# EAGLE schematic AMR3350-V4 (EAGLE 9.2.0)
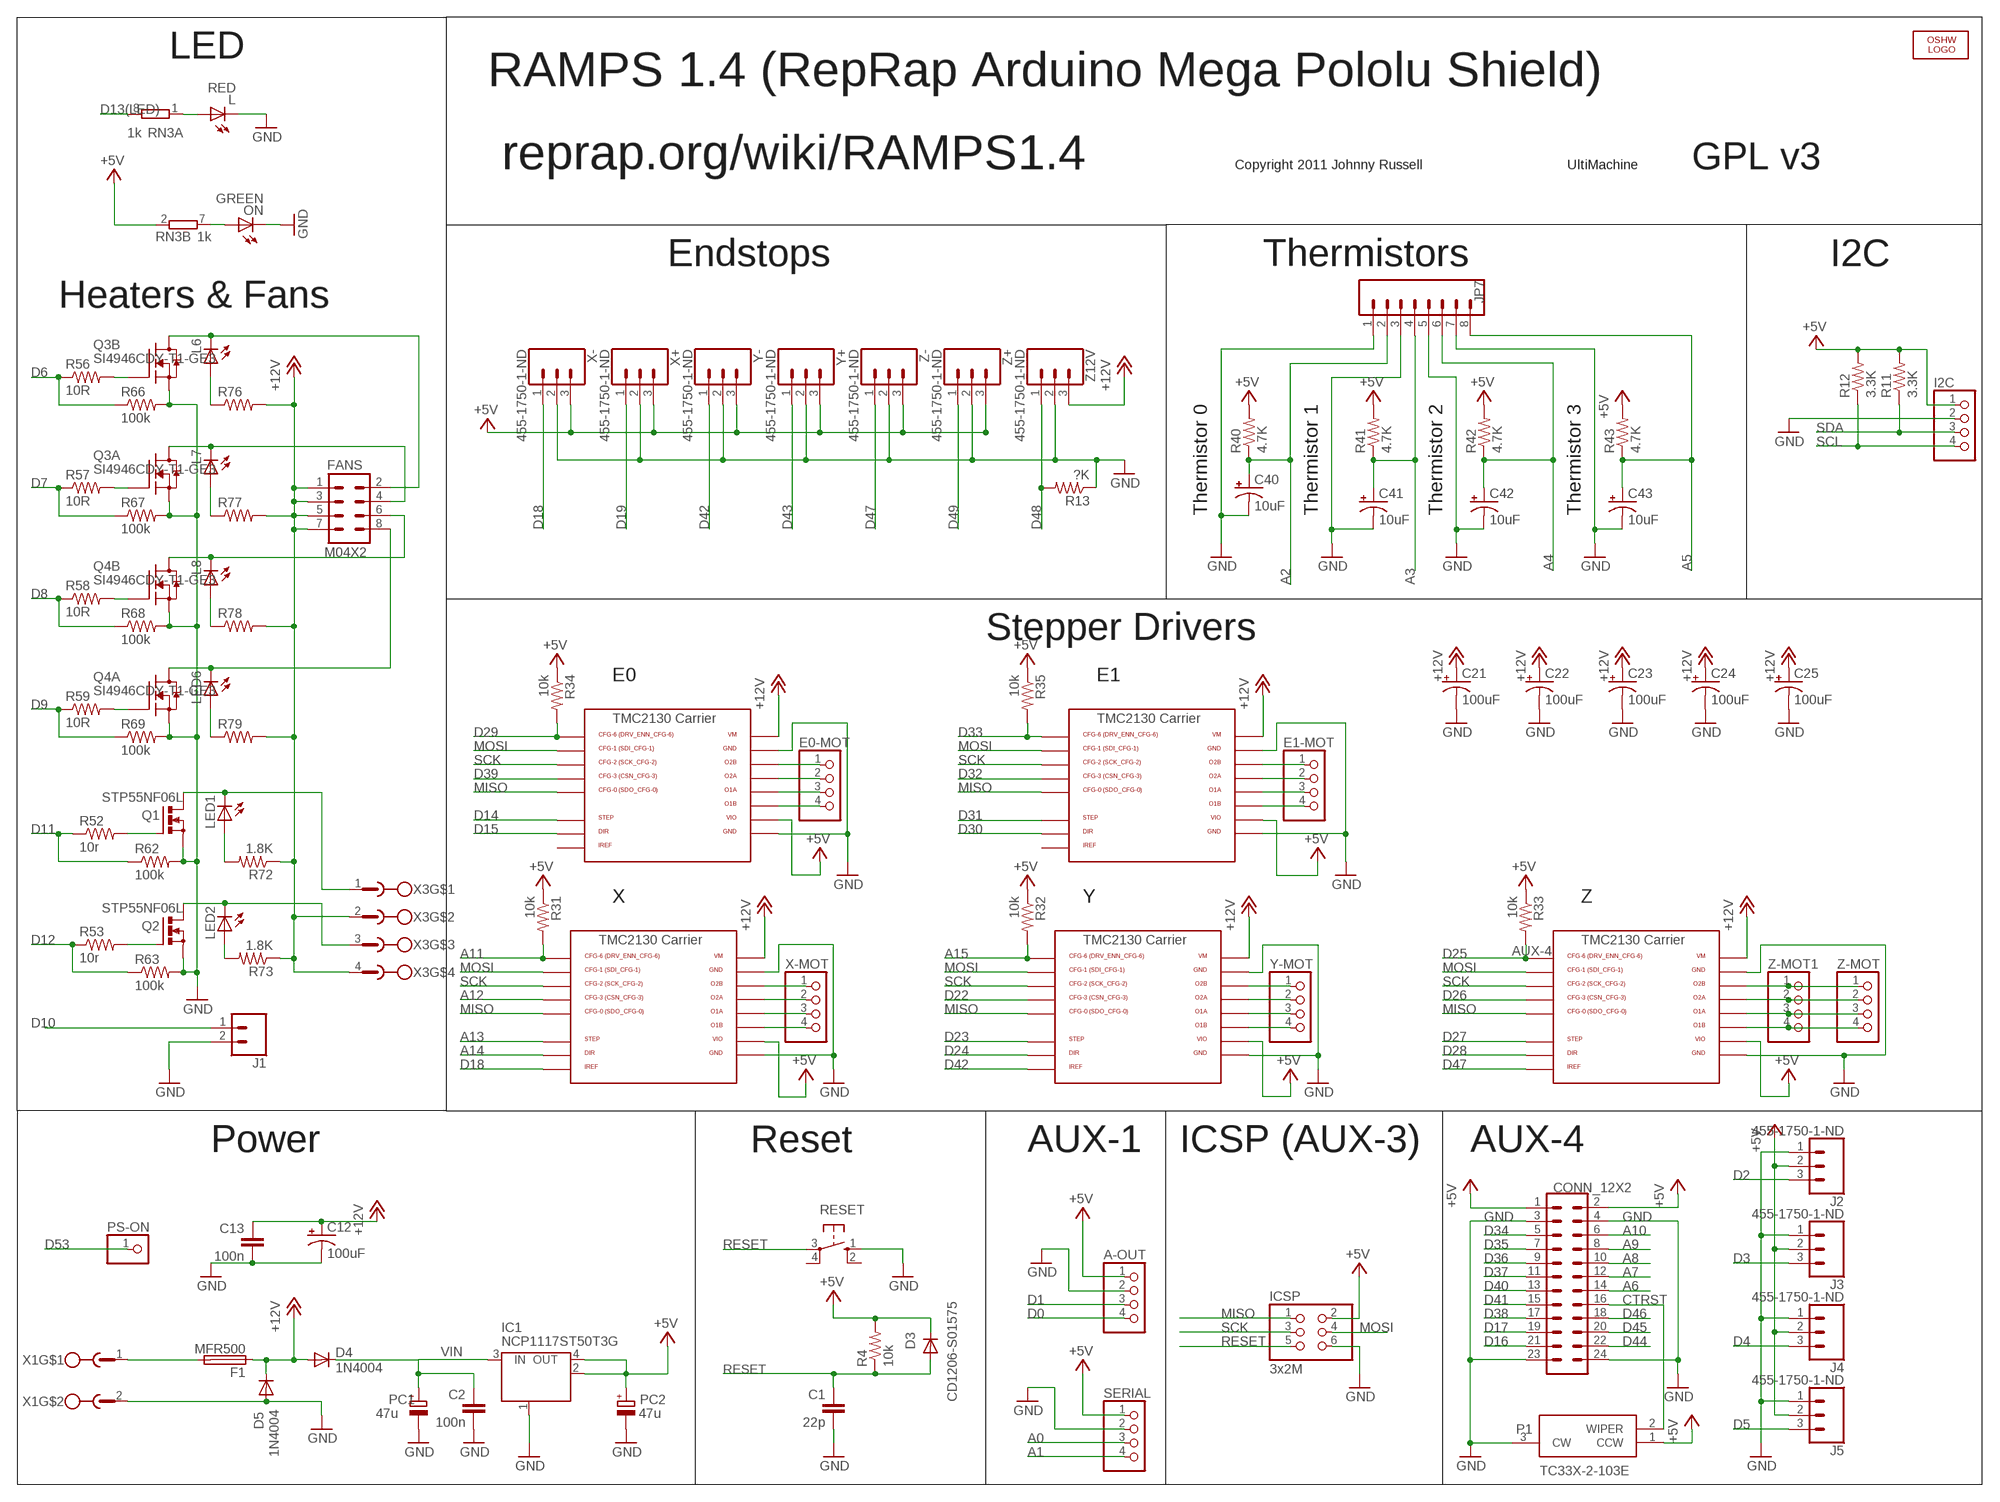
[diagram p0: schematic, sheet 1, part 1 of 2]
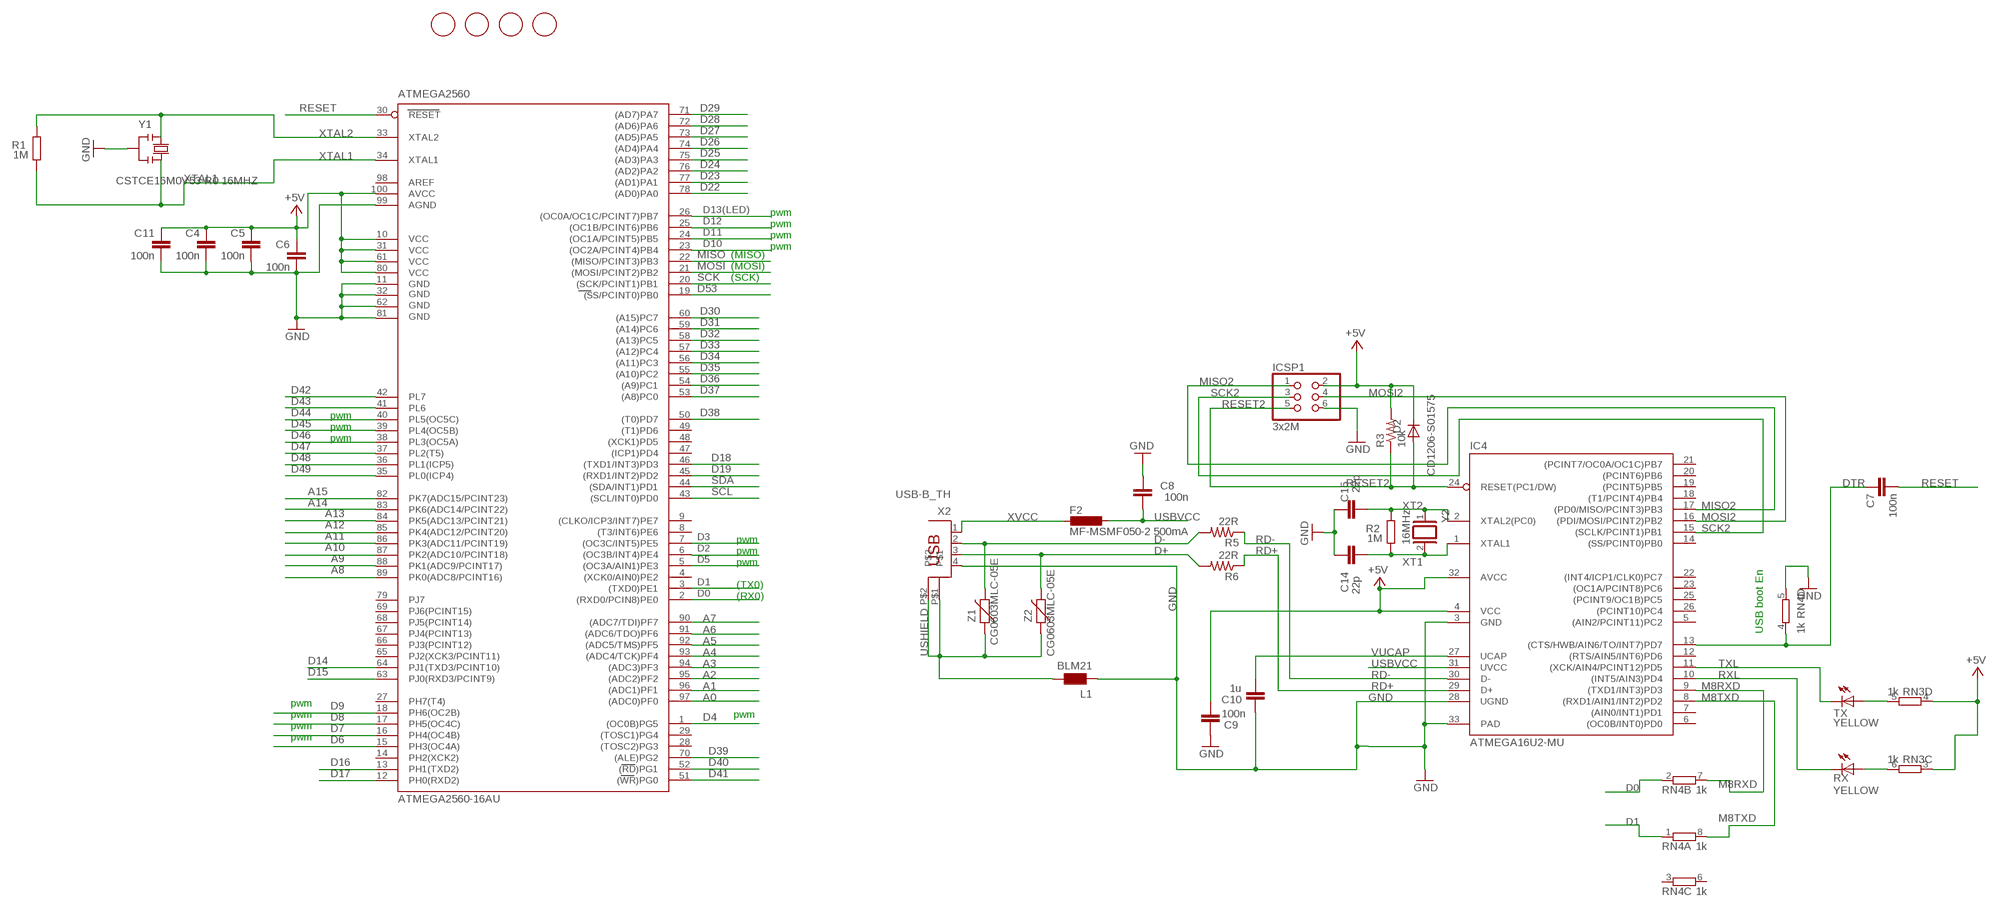
[diagram p1: schematic, sheet 1, part 2 of 2]

## Parts
A-OUT  PINHD-1X4  [1X04]
ATMEGA2560  ATMEGA2560-16AU  ATMEGA25602560-16AU  [TQFP100]
AUX-4  CONN_12X2  [2X12]
C1  22p  C-EU0603-RND  [C0603-ROUND]
C2  100n  C-EU  [C0805RND]
C4  100n  C-EU  [C0805RND]
C5  100n  C-EU0603-RND  [C0603-ROUND]
C6  100n  C-EU0603-RND  [C0603-ROUND]
C7  100n  C-EU0603-RND  [C0603-ROUND]
C8  100n  C-EU0603-RND  [C0603-ROUND]
C9  100n  C-EU0603-RND  [C0603-ROUND]
C10  1u  C-EU0603-RND  [C0603-ROUND]
C11  100n  C-EU0603-RND  [C0603-ROUND]
C12  100uF  CPOL-US153CLV-0605  [153CLV-0605]
C13  100n  C-EU0603-RND  [C0603-ROUND]
C14  22p  C-EU0603-RND  [C0603-ROUND]
C15  22p  C-EU0603-RND  [C0603-ROUND]
C21  100uF  CPOL-US153CLV-0605  [153CLV-0605]
C22  100uF  CPOL-US153CLV-0605  [153CLV-0605]
C23  100uF  CPOL-US153CLV-0605  [153CLV-0605]
C24  100uF  CPOL-US153CLV-0605  [153CLV-0605]
C25  100uF  CPOL-US153CLV-0605  [153CLV-0605]
C40  10uF  CPOL-US153CLV-0405  [153CLV-0405]
C41  10uF  CPOL-US153CLV-0405  [153CLV-0405]
C42  10uF  CPOL-US153CLV-0405  [153CLV-0405]
C43  10uF  CPOL-US153CLV-0405  [153CLV-0405]
D2  CD1206-S01575  DIODE-MINIMELF  [MINIMELF]
D3  CD1206-S01575  DIODE-MINIMELF  [MINIMELF]
D4  1N4004  [DO41-10]
D5  1N4004  [DO41-10]
E0-MOT  PINHD-1X4  [1X04]
E1-MOT  PINHD-1X4  [1X04]
F1  MFR500  PTCFUSE  [MFR500]
F2  MF-MSMF050-2 500mA  L-EUL1812  [L1812]
FANS  M04X2  [2X4]
FD1  FIDUCIALMOUNT  [FIDUCIA-MOUNT]
FD2  FIDUCIALMOUNT  [FIDUCIA-MOUNT]
FD3  FIDUCIALMOUNT  [FIDUCIA-MOUNT]
FD4  FIDUCIALMOUNT  [FIDUCIA-MOUNT]
I2C  PINHD-1X4  [1X04]
IC1  NCP1117ST50T3G  MC33269ST-3.3T3  [SOT223]
IC4  ATMEGA16U2-MU  [MLF32]
ICSP  3x2M  PINHD-2X3  [2X03]
ICSP1  3x2M  PINHD-2X3  [2X03]
J1  CONN_02  [1X02]
J2  455-1750-1-ND  CONN_03  [1X03]
J3  455-1750-1-ND  CONN_03  [1X03]
J4  455-1750-1-ND  CONN_03  [1X03]
J5  455-1750-1-ND  CONN_03  [1X03]
JP7  CONN_08"  [1X08]
L  RED  LEDCHIP-LED0805  [CHIP-LED0805]
L1  BLM21  WE-CBF_0805  [0805]
L6  LEDCHIP-LED0603  [CHIP-LED0603]
L7  LEDCHIP-LED0603  [CHIP-LED0603]
L8  LEDCHIP-LED0603  [CHIP-LED0603]
LED1  LEDCHIP-LED0805  [CHIP-LED0805]
LED2  LEDCHIP-LED0805  [CHIP-LED0805]
LED6  LEDCHIP-LED0603  [CHIP-LED0603]
LOGO2  OSHW_LOGO_6MILX0100-NT  [OSHW_6X100_NOTEXT]
ON  GREEN  LEDCHIP-LED0805  [CHIP-LED0805]
P1  TC33X-2-103E  [TC33X-2_1]
PC1  47u  CPOL-EUD  [PANASONIC_D]
PC2  47u  CPOL-EUD  [PANASONIC_D]
PS-ON  PINHD-1X1  [1X01]
Q1  STP55NF06L  IRF512  [TO220BV]
Q2  STP55NF06L  IRF512  [TO220BV]
Q3  SI4946CDY-T1-GE3  [SOIC127P600X175-8N]
Q4  SI4946CDY-T1-GE3  [SOIC127P600X175-8N]
R1  1M  R-EU_R0603  [R0603-ROUND]
R2  1M  R-EU_R0603  [R0603-ROUND]
R3  10k  R-US_R0603  [R0603]
R4  10k  R-US_R0603  [R0603]
R5  22R  R-US_R0603  [R0603]
R6  22R  R-US_R0603  [R0603]
R11  3.3K  R-US_R0603  [R0603]
R12  3.3K  R-US_R0603  [R0603]
R13  ?K  R-US_R0805  [R0805]
R31  10k  R-US_R0805  [R0805]
R32  10k  R-US_R0805  [R0805]
R33  10k  R-US_R0805  [R0805]
R34  10k  R-US_R0805  [R0805]
R35  10k  R-US_R0805  [R0805]
R40  4.7K  R-US_R0805  [R0805]
R41  4.7K  R-US_R0805  [R0805]
R42  4.7K  R-US_R0805  [R0805]
R43  4.7K  R-US_R0805  [R0805]
R52  10r  R-US_R0805  [R0805]
R53  10r  R-US_M0805  [M0805]
R56  10R  R-US_R0603  [R0603]
R57  10R  R-US_R0603  [R0603]
R58  10R  R-US_R0603  [R0603]
R59  10R  R-US_R0603  [R0603]
R62  100k  R-US_R0805  [R0805]
R63  100k  R-US_R0805  [R0805]
R66  100k  R-US_R0603  [R0603]
R67  100k  R-US_R0603  [R0603]
R68  100k  R-US_R0603  [R0603]
R69  100k  R-US_R0603  [R0603]
R72  1.8K  R-US_R0805  [R0805]
R73  1.8K  R-US_R0805  [R0805]
R76  R-US_R0603  [R0603]
R77  R-US_R0603  [R0603]
R78  R-US_R0603  [R0603]
R79  R-US_R0603  [R0603]
RESET  10-XX  [B3F-10XX]
RN3  1k  4R-NCAY16  [CAY16]
RN4  1k  4R-NCAY16  [CAY16]
RX  YELLOW  LEDCHIP-LED0805  [CHIP-LED0805]
SERIAL  PINHD-1X4  [1X04]
TX  YELLOW  LEDCHIP-LED0805  [CHIP-LED0805]
U$1  TMC2130BREAKOUT  [TMC2130BREAKOUT]
U$2  TMC2130BREAKOUT  [TMC2130BREAKOUT]
U$3  TMC2130BREAKOUT  [TMC2130BREAKOUT]
U$4  TMC2130BREAKOUT  [TMC2130BREAKOUT]
U$5  TMC2130BREAKOUT  [TMC2130BREAKOUT]
X1  2-PIN  [2-PIN]
X2  USB-B_TH  PN61729NOSILK  [PN61729-NOSILK]
X3  4-PIN  [4-PIN]
X+  455-1750-1-ND  CONN_03  [1X03]
X-  455-1750-1-ND  CONN_03  [1X03]
X-MOT  PINHD-1X4  [1X04]
Y1  CSTCE16M0V53-R0 16MHZ  RESONATORMU  [RESONATOR]
Y2  16MHz  XTAL/S  [QS]
Y+  455-1750-1-ND  CONN_03  [1X03]
Y-  455-1750-1-ND  CONN_03  [1X03]
Y-MOT  PINHD-1X4  [1X04]
Z1  CG0603MLC-05E  VARISTORCN0603  [CT/CN0603]
Z2  CG0603MLC-05E  VARISTORCN0603  [CT/CN0603]
Z12V  455-1750-1-ND  CONN_03  [1X03]
Z+  455-1750-1-ND  CONN_03  [1X03]
Z-  455-1750-1-ND  CONN_03  [1X03]
Z-MOT  PINHD-1X4  [1X04]
Z-MOT1  PINHD-1X4  [1X04]

## Nets
12V-IN: F1.2 X1.1
+5V [power usb]: A-OUT.1 ATMEGA2560.10(VCC) ATMEGA2560.31(VCC1) ATMEGA2560.61(VCC2) ATMEGA2560.80(VCC3) ATMEGA2560.100(AVCC) AUX-4.1 AUX-4.2 C4.1 C5.1 C6.1 C9.1 C11.1 D2.C D3.C I2C.1 IC1.2(OUT) IC1.4(OUT) IC4.4(VCC) IC4.32(AVCC) ICSP1.2 ICSP.2 J2.2 J3.2 J4.2 J5.2 P1.1(CCW) PC2.+ R3.2 R4.2 R11.2 R12.2 R31.1 R32.1 R33.1 R34.1 R35.1 R40.2 R41.2 R42.2 R43.2 RN3.2 RN3.3 RN3.4 SERIAL.1 U$1.VIO U$2.VIO U$3.VIO U$4.VIO U$5.VIO X+.3 X-.3 Y+.3 Y-.3 Z+.3 Z-.3
+12V: C12.+ C13.1 C21.+ C22.+ C23.+ C24.+ C25.+ D4.A D5.C F1.1 FANS.1 FANS.3 FANS.5 FANS.7 R72.1 R73.1 R76.2 R77.2 R78.2 R79.2 U$1.VM U$2.VM U$3.VM U$4.VM U$5.VM X3.2 X3.4 Z12V.3
A0: ATMEGA2560.97((ADC0)PF0) SERIAL.3
A1: ATMEGA2560.96((ADC1)PF1) SERIAL.4
A2: ATMEGA2560.95((ADC2)PF2) C40.+ JP7.2 R40.1
A3: ATMEGA2560.94((ADC3)PF3) C41.+ JP7.4 R41.1
A4: ATMEGA2560.93((ADC4/TCK)PF4) C42.+ JP7.6 R42.1
A5: ATMEGA2560.92((ADC5/TMS)PF5) C43.+ JP7.8 R43.1
A6: ATMEGA2560.91((ADC6/TDO)PF6) AUX-4.14
A7: ATMEGA2560.90((ADC7/TDI)PF7) AUX-4.12
A8: ATMEGA2560.89(PK0(ADC8/PCINT16)) AUX-4.10
A9: ATMEGA2560.88(PK1(ADC9/PCINT17)) AUX-4.8
A10: ATMEGA2560.87(PK2(ADC10/PCINT18)) AUX-4.6
A11: ATMEGA2560.86(PK3(ADC11/PCINT19)) R31.2 U$1.CFG-6
A12: ATMEGA2560.85(PK4(ADC12/PCINT20)) U$1.CFG-3
A13: ATMEGA2560.84(PK5(ADC13/PCINT21)) U$1.STEP
A14: ATMEGA2560.83(PK6(ADC14/PCINT22)) U$1.DIR
A15: ATMEGA2560.82(PK7(ADC15/PCINT23)) R32.2 U$2.CFG-6
CTRST: AUX-4.16 P1.2(WIPER)
D0: A-OUT.4 ATMEGA2560.2((RXD0/PCIN8)PE0) RN4.2
D1: A-OUT.3 ATMEGA2560.3((TXD0)PE1) RN4.1
D2: ATMEGA2560.6((OC3B/INT4)PE4) J2.3
D3: ATMEGA2560.7((OC3C/INT5)PE5) J3.3
D4: ATMEGA2560.1((OC0B)PG5) J4.3
D5: ATMEGA2560.5((OC3A/AIN1)PE3) J5.3
D6: ATMEGA2560.15(PH3(OC4A)) R56.1 R66.1
D7: ATMEGA2560.16(PH4(OC4B)) R57.1 R67.1
D8: ATMEGA2560.17(PH5(OC4C)) R58.1 R68.1
D9: ATMEGA2560.18(PH6(OC2B)) R59.1 R69.1
D10: ATMEGA2560.23((OC2A/PCINT4)PB4) J1.1
D11: ATMEGA2560.24((OC1A/PCINT5)PB5) R52.1 R62.1
D12: ATMEGA2560.25((OC1B/PCINT6)PB6) R53.1 R63.1
D13(LED): ATMEGA2560.26((OC0A/OC1C/PCINT7)PB7) RN3.8
D14: ATMEGA2560.64(PJ1(TXD3/PCINT10)) U$5.STEP
D15: ATMEGA2560.63(PJ0(RXD3/PCINT9)) U$5.DIR
D16: ATMEGA2560.13(PH1(TXD2)) AUX-4.21
D17: ATMEGA2560.12(PH0(RXD2)) AUX-4.19
D18: ATMEGA2560.46((TXD1/INT3)PD3) U$1.IREF X-.1
D19: ATMEGA2560.45((RXD1/INT2)PD2) X+.1
D22: ATMEGA2560.78((AD0)PA0) U$2.CFG-3
D23: ATMEGA2560.77((AD1)PA1) U$2.STEP
D24: ATMEGA2560.76((AD2)PA2) U$2.DIR
D25: ATMEGA2560.75((AD3)PA3) R33.2 U$3.CFG-6
D26: ATMEGA2560.74((AD4)PA4) U$3.CFG-3
D27: ATMEGA2560.73((AD5)PA5) U$3.STEP
D28: ATMEGA2560.72((AD6)PA6) U$3.DIR
D29: ATMEGA2560.71((AD7)PA7) R34.2 U$5.CFG-6
D30: ATMEGA2560.60((A15)PC7) U$4.DIR
D31: ATMEGA2560.59((A14)PC6) U$4.STEP
D32: ATMEGA2560.58((A13)PC5) U$4.CFG-3
D33: ATMEGA2560.57((A12)PC4) R35.2 U$4.CFG-6
D34: ATMEGA2560.56((A11)PC3) AUX-4.5
D35: ATMEGA2560.55((A10)PC2) AUX-4.7
D36: ATMEGA2560.54((A9)PC1) AUX-4.9
D37: ATMEGA2560.53((A8)PC0) AUX-4.11
D38: ATMEGA2560.50((T0)PD7) AUX-4.17
D39: ATMEGA2560.70((ALE)PG2) U$5.CFG-3
D40: ATMEGA2560.52((RD)PG1) AUX-4.13
D41: ATMEGA2560.51((WR)PG0) AUX-4.15
D42: ATMEGA2560.42(PL7) U$2.IREF Y-.1
D43: ATMEGA2560.41(PL6) Y+.1
D44: ATMEGA2560.40(PL5(OC5C)) AUX-4.22
D45: ATMEGA2560.39(PL4(OC5B)) AUX-4.20
D46: ATMEGA2560.38(PL3(OC5A)) AUX-4.18
D47: ATMEGA2560.37(PL2(T5)) U$3.IREF Z-.1
D48: ATMEGA2560.36(PL1(ICP5)) R13.2 Z12V.1
D49: ATMEGA2560.35(PL0(ICP4)) Z+.1
D53: ATMEGA2560.19((SS/PCINT0)PB0) PS-ON.1
D+: R6.2 X2.3 Z2.2
D-: R5.2 X2.2 Z1.2
DTR: C7.1 IC4.13((CTS/HWB/AIN6/TO/INT7)PD7) RN4.4
E0-1: E0-MOT.1 U$5.OB2(O2B)
E0-2: E0-MOT.2 U$5.OB1(O2A)
E0-3: E0-MOT.3 U$5.OA1(O1A)
E0-4: E0-MOT.4 U$5.OA2(O1B)
E1-1: E1-MOT.1 U$4.OB2(O2B)
E1-2: E1-MOT.2 U$4.OB1(O2A)
E1-3: E1-MOT.3 U$4.OA1(O1A)
E1-4: E1-MOT.4 U$4.OA2(O1B)
GND [gnd]: A-OUT.2 ATMEGA2560.11(GND) ATMEGA2560.32(GND1) ATMEGA2560.62(GND2) ATMEGA2560.81(GND3) ATMEGA2560.99(AGND) AUX-4.3 AUX-4.4 AUX-4.23 AUX-4.24 C1.2 C2.2 C4.2 C5.2 C6.2 C8.2 C9.2 C10.2 C11.2 C12.- C13.2 C14.2 C15.2 C21.- C22.- C23.- C24.- C25.- C40.- C41.- C42.- C43.- D5.A I2C.2 IC1.1(GND/ADJ) IC4.3(GND) IC4.28(UGND) IC4.33(PAD) ICSP1.6 ICSP.6 J1.2 J2.1 J3.1 J4.1 J5.1 JP7.1 JP7.3 JP7.5 JP7.7 L1.1 L.C ON.C P1.3(CW) PC1.- PC2.- Q1.S Q2.S Q3.1(A:S) Q3.3(B:S) Q4.1(A:S) Q4.3(B:S) R13.1 R62.2 R63.2 R66.2 R67.2 R68.2 R69.2 RESET.1(S) RN4.5 SERIAL.2 U$1.GND U$1.GND@0(GND) U$2.GND U$2.GND@0(GND) U$3.GND U$3.GND@0(GND) U$4.GND U$4.GND@0(GND) U$5.GND U$5.GND@0(GND) X1.2 X2.4 X+.2 X-.2 Y1.2 Y+.2 Y-.2 Z12V.2 Z+.2 Z-.2
L: L.A RN3.1
M8RXD: IC4.9((TXD1/INT3)PD3) RN4.7
M8TXD: IC4.8((RXD1/AIN1/INT2)PD2) RN4.8
MISO: ATMEGA2560.22((MISO/PCINT3)PB3) ICSP.1 U$1.CFG-0 U$2.CFG-0 U$3.CFG-0 U$4.CFG-0 U$5.CFG-0
MISO2: IC4.17((PD0/MISO/PCINT3)PB3) ICSP1.1
MOSI: ATMEGA2560.21((MOSI/PCINT2)PB2) ICSP.4 U$1.CFG-1 U$2.CFG-1 U$3.CFG-1 U$4.CFG-1 U$5.CFG-1
MOSI2: IC4.16((PDI/MOSI/PCINT2)PB2) ICSP1.4
N$1: LED6.A R79.1
N$2: L8.A R78.1
N$4: L6.A R76.1
N$5: L7.A R77.1
N$107: LED2.A R73.2
N$108: LED1.A R72.2
ON: ON.A RN3.7
Q1-D: LED1.C Q1.D X3.1
Q1-G: Q1.G R52.2
Q2-D: LED2.C Q2.D X3.3
Q2-G: Q2.G R53.2
Q6-D: FANS.2 L6.C Q3.5(B:D) Q3.6(B:D)
Q6-G: Q3.4(B:G) R56.2
Q7-D: FANS.4 L7.C Q3.7(A:D) Q3.8(A:D)
Q7-G: Q3.2(A:G) R57.2
Q8-D: FANS.6 L8.C Q4.5(B:D) Q4.6(B:D)
Q8-G: Q4.4(B:G) R58.2
Q9-D: FANS.8 LED6.C Q4.7(A:D) Q4.8(A:D)
Q9-G: Q4.2(A:G) R59.2
RD+: IC4.29(D+) R6.1
RD-: IC4.30(D-) R5.1
RESET: ATMEGA2560.30(RESET) C1.1 C7.2 D3.A ICSP.5 R4.1 RESET.3(P)
RESET2: D2.A IC4.24(RESET(PC1/DW)) ICSP1.5 R3.1
RX: RN3.6 RX.A
RXL: IC4.10((INT5/AIN3)PD4) RX.C
SCK: ATMEGA2560.20((SCK/PCINT1)PB1) ICSP.3 U$1.CFG-2 U$2.CFG-2 U$3.CFG-2 U$4.CFG-2 U$5.CFG-2
SCK2: IC4.15((SCLK/PCINT1)PB1) ICSP1.3
SCL: ATMEGA2560.43((SCL/INT0)PD0) I2C.4 R12.1
SDA: ATMEGA2560.44((SDA/INT1)PD1) I2C.3 R11.1
TX: RN3.5 TX.A
TXL: IC4.11((XCK/AIN4/PCINT12)PD5) TX.C
USBVCC [power usb]: C8.1 F2.1 IC4.31(UVCC)
USHIELD [gnd]: L1.2 X2.P$1 X2.P$2 Z1.1 Z2.1
VIN [power]: C2.1 D4.C IC1.3(IN) PC1.+
VUCAP: C10.1 IC4.27(UCAP)
X-1: U$1.OB2(O2B) X-MOT.1
X-2: U$1.OB1(O2A) X-MOT.2
X-3: U$1.OA1(O1A) X-MOT.3
X-4: U$1.OA2(O1B) X-MOT.4
XT1: C14.1 IC4.1(XTAL1) R2.1 Y2.2
XT2: C15.1 IC4.2(XTAL2(PC0)) R2.2 Y2.1
XTAL1: ATMEGA2560.34(XTAL1) R1.1 Y1.3
XTAL2: ATMEGA2560.33(XTAL2) R1.2 Y1.1
XVCC [power usb]: F2.2 X2.1
Y-1: U$2.OB2(O2B) Y-MOT.1
Y-2: U$2.OB1(O2A) Y-MOT.2
Y-3: U$2.OA1(O1A) Y-MOT.3
Y-4: U$2.OA2(O1B) Y-MOT.4
Z-1: U$3.OB2(O2B) Z-MOT1.1 Z-MOT.1
Z-2: U$3.OB1(O2A) Z-MOT1.2 Z-MOT.2
Z-3: U$3.OA1(O1A) Z-MOT1.3 Z-MOT.3
Z-4: U$3.OA2(O1B) Z-MOT1.4 Z-MOT.4
Unconnected: ATMEGA2560.4((XCK0/AIN0)PE2) ATMEGA2560.8((T3/INT6)PE6) ATMEGA2560.9((CLKO/ICP3/INT7)PE7) ATMEGA2560.14(PH2(XCK2)) ATMEGA2560.27(PH7(T4)) ATMEGA2560.28((TOSC2)PG3) ATMEGA2560.29((TOSC1)PG4) ATMEGA2560.47((ICP1)PD4) ATMEGA2560.48((XCK1)PD5) ATMEGA2560.49((T1)PD6) ATMEGA2560.65(PJ2(XCK3/PCINT11)) ATMEGA2560.66(PJ3(PCINT12)) ATMEGA2560.67(PJ4(PCINT13)) ATMEGA2560.68(PJ5(PCINT14)) ATMEGA2560.69(PJ6(PCINT15)) ATMEGA2560.79(PJ7) ATMEGA2560.98(AREF) IC4.5((AIN2/PCINT11)PC2) IC4.6((OC0B/INT0)PD0) IC4.7((AIN0/INT1)PD1) IC4.12((RTS/AIN5/INT6)PD6) IC4.14((SS/PCINT0)PB0) IC4.18((T1/PCINT4)PB4) IC4.19((PCINT5)PB5) IC4.20((PCINT6)PB6) IC4.21((PCINT7/OC0A/OC1C)PB7) IC4.22((INT4/ICP1/CLK0)PC7) IC4.23((OC1A/PCINT8)PC6) IC4.25((PCINT9/OC1B)PC5) IC4.26((PCINT10)PC4) RESET.2(S1) RESET.4(P1) RN4.3 RN4.6 U$4.IREF U$5.IREF

## Notes on the sheet
- LED
- RAMPS 1.4 (RepRap Arduino Mega Pololu Shield)
- reprap.org/wiki/RAMPS1.4 | Copyright 2011 Johnny Russell | UltiMachine | GPL v3
- Endstops | Thermistors | I2C
- Heaters & Fans
- Thermistor 0 | Thermistor 1 | Thermistor 2 | Thermistor 3
- Stepper Drivers
- E0 | E1
- X | Y | Z
- Power | Reset | AUX-1 | ICSP (AUX-3) | AUX-4
- pwm
- pwm
- pwm
- pwm
- (MISO)
- (MOSI)
- (SCK)
- pwm
- pwm
- pwm
- pwm
- pwm
- pwm
- (TX0)
- (RX0)
- USB boot En
- pwm
- pwm | pwm
- pwm
- pwm

## Library data of the parts
A-OUT E0-MOT E1-MOT I2C SERIAL X-MOT Y-MOT Z-MOT Z-MOT1 = RepRapjr:PINHD-1X4: PIN HEADER
ATMEGA2560 = SmartPrj:ATMEGA2560: MICROCONTROLLER 64/128/256 Kbytes FLASH 4 Kbytes EEPROM 8 Kbytes SRAM 86 General Purpose I/O pins 12-channels16-bit PWM 4 x Serial USARTs 16-channels 10-bit A/D
AUX-4 = SparkFun-Connectors:CONN_12X2: Multi connection point. Often used as Generic Header-pin footprint for 0.1 inch spaced/style header connections On any of the 0.1 inch spaced packages, you can populate with these: Break Away Headers - Straight <https://www.sparkfun.com/products/116> (PRT-00116) Break Away Male Headers - Right Angle <https://www.sparkfun.com/products/553> (PRT-00553) Female Headers <https://www.sparkfun.com/products/115> (PRT-00115) Break Away Headers - Machine Pin <https://www.sparkfun.com/products/117> (PRT-00117) Break Away Female Headers - Swiss Machine Pin <https://www.sparkfun.com/products/743> (PRT-00743)
C1 C2 C4-C11 C13-C15 = SmartPrj:C-EU: CAPACITOR, European symbol
C12 C21-C25 C40-C43 = adafruit:CPOL-US: POLARIZED CAPACITOR, American symbol
D2 D3 = diode:DIODE-: DIODE
D4 D5 = diode:1N4004: DIODE general purpose rectifier, 1 A
F1 = RepRapjr:PTCFUSE: LITTLEFUSE Picofuse/slow Littlefuse
F2 = rcl:L-EU: INDUCTOR, European symbol; SPICEPREFIX: L
FANS = SparkFun:M04X2
FD1-FD4 = SmartPrj:FIDUCIALMOUNT
IC1 = linear:MC33269ST*: Adjustable Output Low Dropout Voltage Regulator 800 mA Source: http://www.onsemi.com/pub/Collateral/MC33269-D.PDF
IC4 = SmartPrj:ATMEGA16U2-
ICSP ICSP1 = SmartPrj:PINHD-2X3: PIN HEADER
J1 = SparkFun-Connectors:CONN_02: Multi connection point. Often used as Generic Header-pin footprint for 0.1 inch spaced/style header connections On any of the 0.1 inch spaced packages, you can populate with these: Break Away Headers - Straight <https://www.sparkfun.com/products/116> (PRT-00116) Break Away Male Headers - Right Angle <https://www.sparkfun.com/products/553> (PRT-00553) Female Headers <https://www.sparkfun.com/products/115> (PRT-00115) Break Away Headers - Machine Pin <https://www.sparkfun.com/products/117> (PRT-00117) Break Away Female Headers - Swiss Machine Pin <https://www.sparkfun.com/products/743> (PRT-00743) For SCREWTERMINALS and SPRING TERMINALS visit here: Screw Terimnals on SparkFun.com <https://www.sparkfun.com/search/results?term=Screw+Terminals> (5mm/3.5mm/2.54mm spacing) This device is also useful as a general connection point to wire up your design to another part of your project. Our various solder wires solder well into these plated through hole pads. Hook-Up Wire - Assortment (Stranded, 22 AWG) <https://www.sparkfun.com/products/11375> (PRT-11375) Hook-Up Wire - Assortment (Solid Core, 22 AWG) <https://www.sparkfun.com/products/11367> (PRT-11367) View the entire wire category on our website here <https://www.sparkfun.com/categories/141> Special notes: Molex polarized connector foot print use with: PRT-08233 with associated crimp pins and housings. 2.54_SCREWTERM for use with PRT-10571. 3.5mm Screw Terminal footprints for PRT-08084 5mm Screw Terminal footprints for use with PRT-08432
J2-J5 X+ X- Y+ Y- Z12V Z+ Z- = SparkFun-Connectors:CONN_03: Multi connection point. Often used as Generic Header-pin footprint for 0.1 inch spaced/style header connections On any of the 0.1 inch spaced packages, you can populate with these: Break Away Headers - Straight <https://www.sparkfun.com/products/116> (PRT-00116) Break Away Male Headers - Right Angle <https://www.sparkfun.com/products/553> (PRT-00553) Female Headers <https://www.sparkfun.com/products/115> (PRT-00115) Break Away Headers - Machine Pin <https://www.sparkfun.com/products/117> (PRT-00117) Break Away Female Headers - Swiss Machine Pin <https://www.sparkfun.com/products/743> (PRT-00743) Stackable Header - 3 Pin (Female, 0.1") <https://www.sparkfun.com/products/13875> (PRT-13875) For SCREWTERMINALS and SPRING TERMINALS visit here: Screw Terimnals on SparkFun.com <https://www.sparkfun.com/search/results?term=Screw+Terminals> (5mm/3.5mm/2.54mm spacing) This device is also useful as a general connection point to wire up your design to another part of your project. Our various solder wires solder well into these plated through hole pads. Hook-Up Wire - Assortment (Stranded, 22 AWG) <https://www.sparkfun.com/products/11375> (PRT-11375) Hook-Up Wire - Assortment (Solid Core, 22 AWG) <https://www.sparkfun.com/products/11367> (PRT-11367) View the entire wire category on our website here <https://www.sparkfun.com/categories/141> Special notes: Molex polarized connector foot print use with SKU : PRT-08232 with associated crimp pins and housings.; PROD_ID: XXX-00000
JP7 = SparkFun-Connectors:CONN_08: Multi connection point. Often used as Generic Header-pin footprint for 0.1 inch spaced/style header connections On any of the 0.1 inch spaced packages, you can populate with these: Break Away Headers - Straight <https://www.sparkfun.com/products/116> (PRT-00116) Break Away Male Headers - Right Angle <https://www.sparkfun.com/products/553> (PRT-00553) Female Headers <https://www.sparkfun.com/products/115> (PRT-00115) Break Away Headers - Machine Pin <https://www.sparkfun.com/products/117> (PRT-00117) Break Away Female Headers - Swiss Machine Pin <https://www.sparkfun.com/products/743> (PRT-00743) Arduino Stackable Header - 8 Pin <https://www.sparkfun.com/products/9279> (PRT-09279) For SCREWTERMINALS and SPRING TERMINALS visit here: Screw Terimnals on SparkFun.com <https://www.sparkfun.com/search/results?term=Screw+Terminals> (5mm/3.5mm/2.54mm spacing) This device is also useful as a general connection point to wire up your design to another part of your project. Our various solder wires solder well into these plated through hole pads. Hook-Up Wire - Assortment (Stranded, 22 AWG) <https://www.sparkfun.com/products/11375> (PRT-11375) Hook-Up Wire - Assortment (Solid Core, 22 AWG) <https://www.sparkfun.com/products/11367> (PRT-11367) View the entire wire category on our website here <https://www.sparkfun.com/categories/141> Special notes: Molex polarized connector foot print use with SKU : PRT-08231 with associated crimp pins and housings. 1MM SMD Version SKU: PRT-10208 NOTES ON THE VARIANTS LOCK and LOCK_LONGPADS... This footprint was designed to help hold the alignment of a through-hole component (i.e. 6-pin header) while soldering it into place. You may notice that each hole has been shifted either up or down by 0.005 of an inch from it's more standard position (which is a perfectly straight line). This slight alteration caused the pins (the squares in the middle) to touch the edges of the holes. Because they are alternating, it causes a "brace" to hold the component in place. 0.005 has proven to be the perfect amount of "off-center" position when using our standard breakaway headers. Although looks a little odd when you look at the bare footprint, once you have a header in there, the alteration is very hard to notice. Also,if you push a header all the way into place, it is covered up entirely on the bottom side.; PROD_ID: CONN-08438
L L6-L8 LED1 LED2 LED6 ON RX TX = led:LED: LED OSRAM: - CHIPLED LG R971, LG N971, LY N971, LG Q971, LY Q971, LO R971, LY R971 LH N974, LH R974 LS Q976, LO Q976, LY Q976 LO Q996 - Hyper CHIPLED LW Q18S LB Q993, LB Q99A, LB R99A - SideLED LS A670, LO A670, LY A670, LG A670, LP A670 LB A673, LV A673, LT A673, LW A673 LH A674 LY A675 LS A676, LA A676, LO A676, LY A676, LW A676 LS A679, LY A679, LG A679 - Hyper Micro SIDELED® LS Y876, LA Y876, LO Y876, LY Y876 LT Y87S - SmartLED LW L88C, LW L88S LB L89C, LB L89S, LG L890 LS L89K, LO L89K, LY L89K LS L896, LA L896, LO L896, LY L896 - TOPLED LS T670, LO T670, LY T670, LG T670, LP T670 LSG T670, LSP T670, LSY T670, LOP T670, LYG T670 LG T671, LOG T671, LSG T671 LB T673, LV T673, LT T673, LW T673 LH T674 LS T676, LA T676, LO T676, LY T676, LB T676, LH T676, LSB T676, LW T676 LB T67C, LV T67C, LT T67C, LS T67K, LO T67K, LY T67K, LW E67C LS E67B, LA E67B, LO E67B, LY E67B, LB E67C, LV E67C, LT E67C LW T67C LS T679, LY T679, LG T679 LS T770, LO T770, LY T770, LG T770, LP T770 LB T773, LV T773, LT T773, LW T773 LH T774 LS E675, LA E675, LY E675, LS T675 LS T776, LA T776, LO T776, LY T776, LB T776 LHGB T686 LT T68C, LB T68C - Hyper Mini TOPLED® LB M676 - Mini TOPLED Santana® LG M470 LS M47K, LO M47K, LY M47K Source: http://www.osram.convergy.de LUXEON: - LUMILED® LXK2-PW12-R00, LXK2-PW12-S00, LXK2-PW14-U00, LXK2-PW14-V00 LXK2-PM12-R00, LXK2-PM12-S00, LXK2-PM14-U00 LXK2-PE12-Q00, LXK2-PE12-R00, LXK2-PE12-S00, LXK2-PE14-T00, LXK2-PE14-U00 LXK2-PB12-K00, LXK2-PB12-L00, LXK2-PB12-M00, LXK2-PB14-N00, LXK2-PB14-P00, LXK2-PB14-Q00 LXK2-PR12-L00, LXK2-PR12-M00, LXK2-PR14-Q00, LXK2-PR14-R00 LXK2-PD12-Q00, LXK2-PD12-R00, LXK2-PD12-S00 LXK2-PH12-R00, LXK2-PH12-S00 LXK2-PL12-P00, LXK2-PL12-Q00, LXK2-PL12-R00 Source: www.luxeon.com KINGBRIGHT: KA-3528ASYC Source: www.kingbright.com
L1 = wuerth-elektronik:WE-CBF: SMD EMI Suppression Ferrite Beads - excellent anti-EMI properties - low DCR - impedances till 3000 ohms - rated current up to 6 A
LOGO2 = OSHW:OSHW_LOGO_6MIL
P1 = TC33X-2-103E:TC33X-2-103E: Cermet 3mm SMT trimmer,0.1W 10k Bourns TC33 Series SMD Cermet Trimmer Resistor with Solder Pad Terminations, 10k?? ??25% 1/10W ??250ppm/??C Top Adjust Source: Datasheet <https://www.bourns.com/pdfs/TC33.pdf>; ALLIED_NUMBER: 70153492; ALLIED_PRICE-STOCK: http://www.alliedelec.com/bourns-tc33x-2-103e/70153492/; ARROW_PART_NUMBER: TC33X-2-103E; ARROW_PRICE-STOCK: https://www.arrow.com/en/products/tc33x-2-103e/bourns; DESCRIPTION: Cermet 3mm SMT trimmer,0.1W 10k Bourns TC33 Series SMD Cermet Trimmer Resistor with Solder Pad Terminations, 10k?? ??25% 1/10W ??250ppm/??C Top Adjust; HEIGHT: mm; MANUFACTURER_NAME: Bourns; MANUFACTURER_PART_NUMBER: TC33X-2-103E; RS_PART_NUMBER: 1673549; RS_PRICE-STOCK: http://uk.rs-online.com/web/p/products/1673549
PC1 PC2 = rcl:CPOL-EU: POLARIZED CAPACITOR, European symbol; SPICEPREFIX: C
PS-ON = adafruit:PINHD-1X1: Pin header 1x1 for 0.1" spacing With round pins
Q1 Q2 = transistor-power:IRF512: N-CHANNEL MOS FET
Q3 Q4 = SI4946CDY-T1-GE3:SI4946CDY-T1-GE3
R1 R2 = SmartPrj:R-EU_: RESISTOR, European symbol
R3-R6 R52 R53 R56-R59 R66-R69 R76-R79 = resistor:R-US_: RESISTOR, American symbol
R11-R13 R31-R35 R40-R43 R62 R63 R72 R73 = adafruit:R-US_: RESISTOR, American symbol
RESET = switch-omron:10-XX: OMRON SWITCH; MPN: B3F-1000; OC_FARNELL: 176432; OC_NEWARK: 36M3542
RN3 RN4 = resistor-dil:4R-N: Array Chip Resistor Source: RS Component / Phycomp; OC_FARNELL: unknown; OC_NEWARK: unknown
U$1-U$5 = TMC2130:TMC2130BREAKOUT
X1 = con-508-gen:2-PIN
X2 = SmartPrj:PN61729: BERG USB connector
X3 = con-508-gen:4-PIN
Y1 = SmartPrj:RESONATOR
Y2 = SmartPrj:XTAL/S: CRYSTAL
Z1 Z2 = varistor:VARISTOR: VARISTOR

## Net classes
1 power: width 0.203 mm, drill 0.406 mm, clearance 0.203 mm
2 gnd: width 0.203 mm, drill 0.406 mm, clearance 0.203 mm
3 power usb: width 0.203 mm, drill 0.406 mm, clearance 0.203 mm